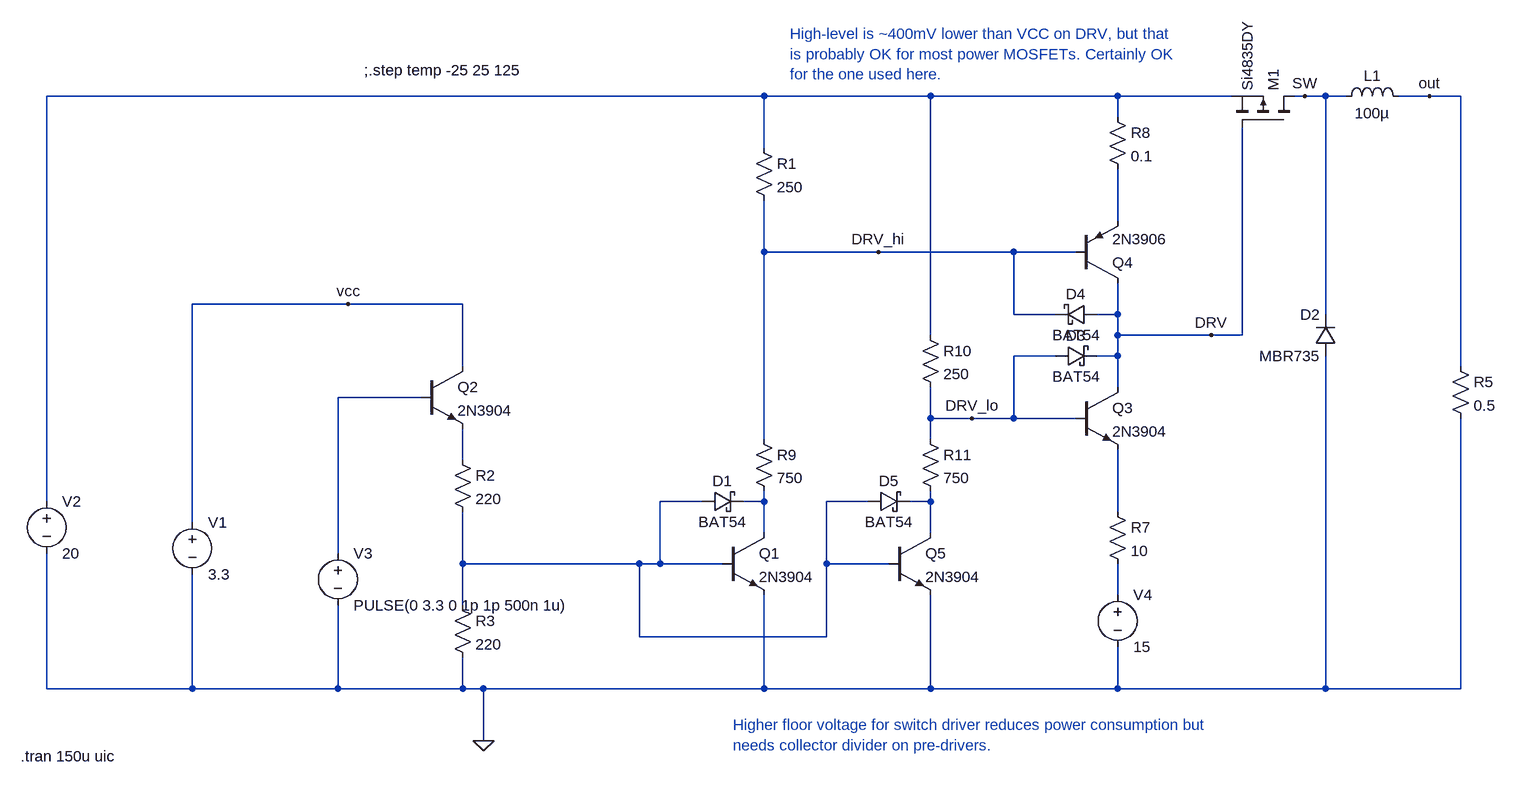
[diagram p0: schematic switch_driver1.asc]
switch_driver1.asc, the LTspice schematic file:
Version 4.1
SHEET 1 2652 744
WIRE 1520 -288 416 -288
WIRE 1776 -288 1520 -288
WIRE 2064 -288 1776 -288
WIRE 2240 -288 2064 -288
WIRE 2352 -288 2336 -288
WIRE 2384 -288 2352 -288
WIRE 2416 -288 2384 -288
WIRE 2544 -288 2496 -288
WIRE 2592 -288 2544 -288
WIRE 2064 -256 2064 -288
WIRE 1520 -208 1520 -288
WIRE 2064 -96 2064 -176
WIRE 1520 -48 1520 -128
WIRE 1696 -48 1520 -48
WIRE 1904 -48 1696 -48
WIRE 2000 -48 1904 -48
WIRE 880 32 640 32
WIRE 1056 32 880 32
WIRE 1904 48 1904 -48
WIRE 1968 48 1904 48
WIRE 2064 48 2064 0
WIRE 2064 48 2032 48
WIRE 2384 48 2384 -288
WIRE 1776 80 1776 -288
WIRE 2064 80 2064 48
WIRE 2208 80 2064 80
WIRE 2256 80 2256 -240
WIRE 2256 80 2208 80
WIRE 1968 112 1904 112
WIRE 2064 112 2064 80
WIRE 2064 112 2032 112
WIRE 1056 128 1056 32
WIRE 2592 128 2592 -288
WIRE 2064 160 2064 112
WIRE 992 176 864 176
WIRE 1776 208 1776 160
WIRE 1840 208 1776 208
WIRE 1904 208 1904 112
WIRE 1904 208 1840 208
WIRE 2000 208 1904 208
WIRE 1520 240 1520 -48
WIRE 1776 240 1776 208
WIRE 1056 272 1056 224
WIRE 416 336 416 -288
WIRE 1424 336 1360 336
WIRE 1520 336 1520 320
WIRE 1520 336 1488 336
WIRE 1680 336 1616 336
WIRE 1776 336 1776 320
WIRE 1776 336 1744 336
WIRE 2064 352 2064 256
WIRE 640 368 640 32
WIRE 1520 384 1520 336
WIRE 1776 384 1776 336
WIRE 864 416 864 176
WIRE 1056 432 1056 352
WIRE 1328 432 1056 432
WIRE 1360 432 1360 336
WIRE 1360 432 1328 432
WIRE 1456 432 1360 432
WIRE 1616 432 1616 336
WIRE 1712 432 1616 432
WIRE 2064 480 2064 432
WIRE 1056 496 1056 432
WIRE 1328 544 1328 432
WIRE 1616 544 1616 432
WIRE 1616 544 1328 544
WIRE 416 624 416 416
WIRE 640 624 640 448
WIRE 640 624 416 624
WIRE 864 624 864 496
WIRE 864 624 640 624
WIRE 1056 624 1056 576
WIRE 1056 624 864 624
WIRE 1088 624 1056 624
WIRE 1520 624 1520 480
WIRE 1520 624 1088 624
WIRE 1776 624 1776 480
WIRE 1776 624 1520 624
WIRE 2064 624 2064 560
WIRE 2064 624 1776 624
WIRE 2384 624 2384 112
WIRE 2384 624 2064 624
WIRE 2592 624 2592 208
WIRE 2592 624 2384 624
WIRE 1088 704 1088 624
FLAG 1696 -48 DRV_hi
FLAG 1088 704 0
FLAG 880 32 vcc
FLAG 2208 80 DRV
FLAG 2352 -288 SW
FLAG 2544 -288 out
FLAG 1840 208 DRV_lo
SYMBOL voltage 640 352 R0
SYMATTR InstName V1
SYMATTR Value 3.3
SYMBOL voltage 416 320 R0
SYMATTR InstName V2
SYMATTR Value 20
SYMBOL npn 1456 384 R0
SYMATTR InstName Q1
SYMATTR Value 2N3904
SYMBOL schottky 1424 352 R270
WINDOW 0 32 32 VTop 2
WINDOW 3 0 32 VBottom 2
SYMATTR InstName D1
SYMATTR Value BAT54
SYMATTR Description Diode
SYMATTR Type diode
SYMBOL npn 992 128 R0
SYMATTR InstName Q2
SYMATTR Value 2N3904
SYMBOL res 1504 -224 R0
SYMATTR InstName R1
SYMATTR Value 250
SYMBOL res 1040 256 R0
SYMATTR InstName R2
SYMATTR Value 220
SYMBOL res 1040 480 R0
SYMATTR InstName R3
SYMATTR Value 220
SYMBOL voltage 864 400 R0
WINDOW 123 0 0 Left 0
WINDOW 39 0 0 Left 0
SYMATTR InstName V3
SYMATTR Value PULSE(0 3.3 0 1p 1p 500n 1u)
SYMBOL npn 2000 160 R0
SYMATTR InstName Q3
SYMATTR Value 2N3904
SYMBOL pnp 2000 0 M180
SYMATTR InstName Q4
SYMATTR Value 2N3906
SYMBOL ind 2400 -272 R270
WINDOW 0 32 56 VTop 2
WINDOW 3 5 56 VBottom 2
SYMATTR InstName L1
SYMATTR Value 100µ
SYMBOL res 2576 112 R0
SYMATTR InstName R5
SYMATTR Value 0.5
SYMBOL diode 2400 112 R180
WINDOW 0 24 64 Left 2
WINDOW 3 24 0 Left 2
SYMATTR InstName D2
SYMATTR Value MBR735
SYMBOL schottky 1968 128 R270
WINDOW 0 32 32 VTop 2
WINDOW 3 0 32 VBottom 2
SYMATTR InstName D3
SYMATTR Value BAT54
SYMATTR Description Diode
SYMATTR Type diode
SYMBOL schottky 2032 64 M270
WINDOW 0 32 32 VTop 2
WINDOW 3 0 32 VBottom 2
SYMATTR InstName D4
SYMATTR Value BAT54
SYMATTR Description Diode
SYMATTR Type diode
SYMBOL res 2048 336 R0
SYMATTR InstName R7
SYMATTR Value 10
SYMBOL pmos 2336 -240 M270
SYMATTR InstName M1
SYMATTR Value Si4835DY
SYMBOL res 2048 -272 R0
SYMATTR InstName R8
SYMATTR Value 0.1
SYMBOL voltage 2064 464 R0
SYMATTR InstName V4
SYMATTR Value 15
SYMBOL res 1504 224 R0
SYMATTR InstName R9
SYMATTR Value 750
SYMBOL npn 1712 384 R0
SYMATTR InstName Q5
SYMATTR Value 2N3904
SYMBOL schottky 1680 352 R270
WINDOW 0 32 32 VTop 2
WINDOW 3 0 32 VBottom 2
SYMATTR InstName D5
SYMATTR Value BAT54
SYMATTR Description Diode
SYMATTR Type diode
SYMBOL res 1760 64 R0
SYMATTR InstName R10
SYMATTR Value 250
SYMBOL res 1760 224 R0
SYMATTR InstName R11
SYMATTR Value 750
TEXT 376 728 Left 2 !.tran 150u uic
TEXT 904 -328 Left 2 !;.step temp -25 25 125
TEXT 1472 680 Left 2 ;Higher floor voltage for switch driver reduces power consumption but\nneeds collector divider on pre-drivers.
TEXT 1560 -384 Left 2 ;High-level is ~400mV lower than VCC on DRV, but that\nis probably OK for most power MOSFETs. Certainly OK\nfor the one used here.

The netlist it stands for:
* switch_driver1.asc
V1 vcc 0 3.3
V2 N001 0 20
Q1 N006 N005 0 0 2N3904
D1 N005 N006 BAT54
Q2 vcc N003 N004 0 2N3904
R1 N001 DRV_hi 250
R2 N004 N005 220
R3 N005 0 220
V3 N003 0 PULSE(0 3.3 0 1p 1p 500n 1u)
Q3 DRV DRV_lo N008 0 2N3904
Q4 DRV DRV_hi N002 0 2N3906
L1 SW out 100µ
R5 out 0 0.5
D2 0 SW MBR735
D3 DRV_lo DRV BAT54
D4 DRV DRV_hi BAT54
R7 N008 N009 10
M1 SW DRV N001 N001 Si4835DY
R8 N001 N002 0.1
V4 N009 0 15
R9 DRV_hi N006 750
Q5 N007 N005 0 0 2N3904
D5 N005 N007 BAT54
R10 N001 DRV_lo 250
R11 DRV_lo N007 750
.model D D
.lib standard.dio
.model NPN NPN
.model PNP PNP
.lib standard.bjt
.model NMOS NMOS
.model PMOS PMOS
.lib standard.mos
.tran 150u uic
;.step temp -25 25 125
* Higher floor voltage for switch driver reduces power consumption but
* needs collector divider on pre-drivers.
* High-level is ~400mV lower than VCC on DRV, but that
* is probably OK for most power MOSFETs. Certainly OK
* for the one used here.
.backanno
.end